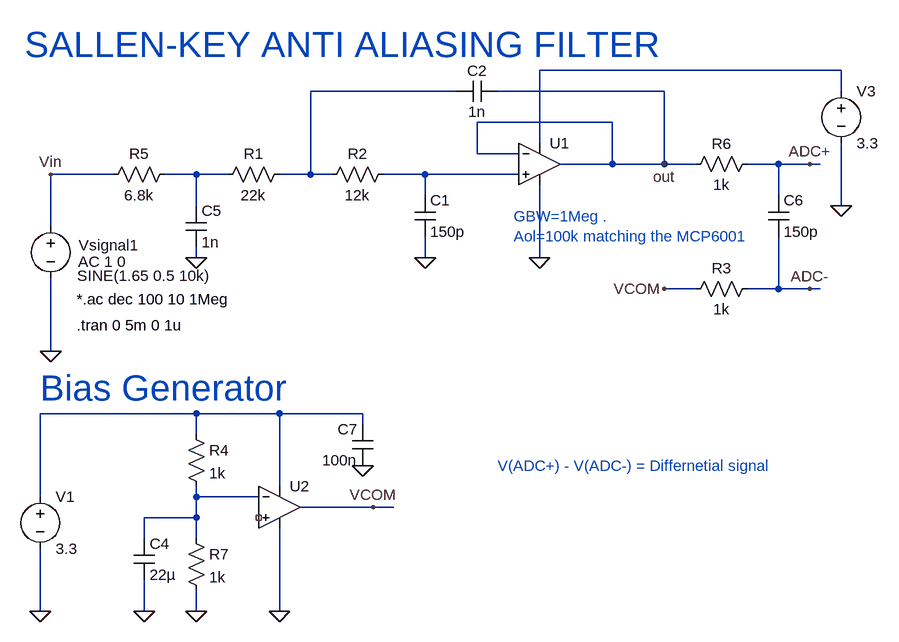
[diagram p0: schematic LTspice_Sallen_Key_Diff_Output.asc]
LTspice_Sallen_Key_Diff_Output.asc, the LTspice schematic file:
Version 4.1
SHEET 1 1288 1524
WIRE 848 128 384 128
WIRE 256 160 32 160
WIRE 576 160 320 160
WIRE 848 160 848 128
WIRE 496 208 288 208
WIRE 384 240 384 128
WIRE 288 256 288 208
WIRE 352 256 288 256
WIRE 496 272 496 208
WIRE 496 272 416 272
WIRE 576 272 576 160
WIRE 576 272 496 272
WIRE 624 272 576 272
WIRE 752 272 704 272
WIRE 800 272 752 272
WIRE 816 272 800 272
WIRE -272 288 -368 288
WIRE -144 288 -192 288
WIRE -96 288 -144 288
WIRE 32 288 32 160
WIRE 32 288 -16 288
WIRE 64 288 32 288
WIRE 208 288 144 288
WIRE 352 288 208 288
WIRE 208 320 208 288
WIRE 752 320 752 272
WIRE -144 336 -144 288
WIRE 848 336 848 240
WIRE -368 368 -368 288
WIRE -144 416 -144 400
WIRE 208 416 208 384
WIRE 384 416 384 304
WIRE 624 464 576 464
WIRE 752 464 752 384
WIRE 752 464 704 464
WIRE 800 464 752 464
WIRE 816 464 800 464
WIRE -368 560 -368 448
WIRE -144 656 -384 656
WIRE -16 656 -144 656
WIRE 112 656 -16 656
WIRE 112 672 112 656
WIRE -144 688 -144 656
WIRE -16 768 -16 656
WIRE -384 784 -384 656
WIRE -144 784 -144 768
WIRE -48 784 -144 784
WIRE 128 800 16 800
WIRE 160 800 128 800
WIRE -144 816 -144 784
WIRE -144 816 -224 816
WIRE -224 848 -224 816
WIRE -144 848 -144 816
WIRE -384 960 -384 864
WIRE -224 960 -224 912
WIRE -144 960 -144 928
WIRE -16 960 -16 832
FLAG -368 560 0
FLAG 208 416 0
FLAG 576 272 out
FLAG 384 416 0
FLAG 848 336 0
FLAG -144 416 0
FLAG 800 272 ADC+
FLAG -368 288 Vin
FLAG 576 464 VCOM
FLAG 800 464 ADC-
FLAG 112 736 0
FLAG -224 960 0
FLAG -144 960 0
FLAG -384 960 0
FLAG -16 960 0
FLAG 128 800 VCOM
SYMBOL res 0 272 R90
WINDOW 0 0 56 VBottom 2
WINDOW 3 32 56 VTop 2
SYMATTR InstName R1
SYMATTR Value 22k
SYMBOL res 160 272 R90
WINDOW 0 0 56 VBottom 2
WINDOW 3 32 56 VTop 2
SYMATTR InstName R2
SYMATTR Value 12k
SYMBOL cap 192 320 R0
SYMATTR InstName C1
SYMATTR Value 150p
SYMBOL cap 320 144 R90
WINDOW 0 0 32 VBottom 2
WINDOW 3 32 32 VTop 2
SYMATTR InstName C2
SYMATTR Value 1n
SYMBOL voltage -368 352 R0
WINDOW 123 42 70 Left 2
WINDOW 39 0 0 Left 0
WINDOW 3 41 92 Left 2
WINDOW 0 43 45 Left 2
SYMATTR Value2 AC 1 0
SYMATTR Value SINE(1.65 0.5 10k)
SYMATTR InstName Vsignal1
SYMBOL voltage 848 144 R0
WINDOW 123 0 0 Left 0
WINDOW 39 0 0 Left 0
SYMATTR InstName V3
SYMATTR Value 3.3
SYMBOL res -176 272 R90
WINDOW 0 0 56 VBottom 2
WINDOW 3 32 56 VTop 2
SYMATTR InstName R5
SYMATTR Value 6.8k
SYMBOL cap -160 336 R0
SYMATTR InstName C5
SYMATTR Value 1n
SYMBOL res 720 256 R90
WINDOW 0 0 56 VBottom 2
WINDOW 3 32 56 VTop 2
SYMATTR InstName R6
SYMATTR Value 1k
SYMBOL cap 736 320 R0
SYMATTR InstName C6
SYMATTR Value 150p
SYMBOL OpAmps\\UniversalOpAmp2 384 272 R0
SYMATTR InstName U1
SYMBOL res 720 448 R90
WINDOW 0 0 56 VBottom 2
WINDOW 3 32 56 VTop 2
SYMATTR InstName R3
SYMATTR Value 1k
SYMBOL OpAmps\\UniversalOpAmp2 -16 800 R0
SYMATTR InstName U2
SYMBOL res -160 672 R0
SYMATTR InstName R4
SYMATTR Value 1k
SYMBOL res -160 832 R0
SYMATTR InstName R7
SYMATTR Value 1k
SYMBOL cap -240 848 R0
SYMATTR InstName C4
SYMATTR Value 22µ
SYMBOL cap 128 736 R180
WINDOW 0 24 56 Left 2
WINDOW 3 24 8 Left 2
SYMATTR InstName C7
SYMATTR Value 100n
SYMBOL voltage -384 768 R0
WINDOW 123 0 0 Left 0
WINDOW 39 0 0 Left 0
SYMATTR InstName V1
SYMATTR Value 3.3
TEXT -408 88 Left 5 ;SALLEN-KEY ANTI ALIASING FILTER
TEXT -328 480 Left 2 !*.ac dec 100 10 1Meg
TEXT 344 352 Left 2 ;GBW=1Meg .\nAol=100k matching the MCP6001
TEXT -328 520 Left 2 !.tran 0 5m 0 1u
TEXT 320 736 Left 2 ;V(ADC+) - V(ADC-) = Differnetial signal
TEXT -384 616 Left 5 ;Bias Generator

The netlist it stands for:
* LTspice_Sallen_Key_Diff_Output.asc
R1 N002 N003 22k
R2 N004 N002 12k
C1 N004 0 150p
C2 out N002 1n
Vsignal1 Vin 0 SINE(1.65 0.5 10k) AC 1 0
V3 N001 0 3.3
R5 N003 Vin 6.8k
C5 N003 0 1n
R6 ADC+ out 1k
C6 ADC+ ADC- 150p
X§U1 N004 out N001 0 out level2 Avol=1Meg GBW=10Meg Slew=10Meg Ilimit=25m Rail=0 Vos=0 En=0 Enk=0 In=0 Ink=0 Rin=500Meg  ; pins In+ In- V+ V- OUT
R3 ADC- VCOM 1k
X§U2 NC_01 N006 N005 0 VCOM level2 Avol=1Meg GBW=10Meg Slew=10Meg Ilimit=25m Rail=0 Vos=0 En=0 Enk=0 In=0 Ink=0 Rin=500Meg  ; pins In+ In- V+ V- OUT
R4 N005 N006 1k
R7 N006 0 1k
C4 N006 0 22µ
C7 0 N005 100n
V1 N005 0 3.3
* SALLEN-KEY ANTI ALIASING FILTER
*.ac dec 100 10 1Meg
* GBW=1Meg .
* Aol=100k matching the MCP6001
.tran 0 5m 0 1u
* V(ADC+) - V(ADC-) = Differnetial signal
* Bias Generator
.lib UniversalOpAmp2.lib
.backanno
.end